# EAGLE design hello.ftdi.44.guillem (EAGLE 5.11)
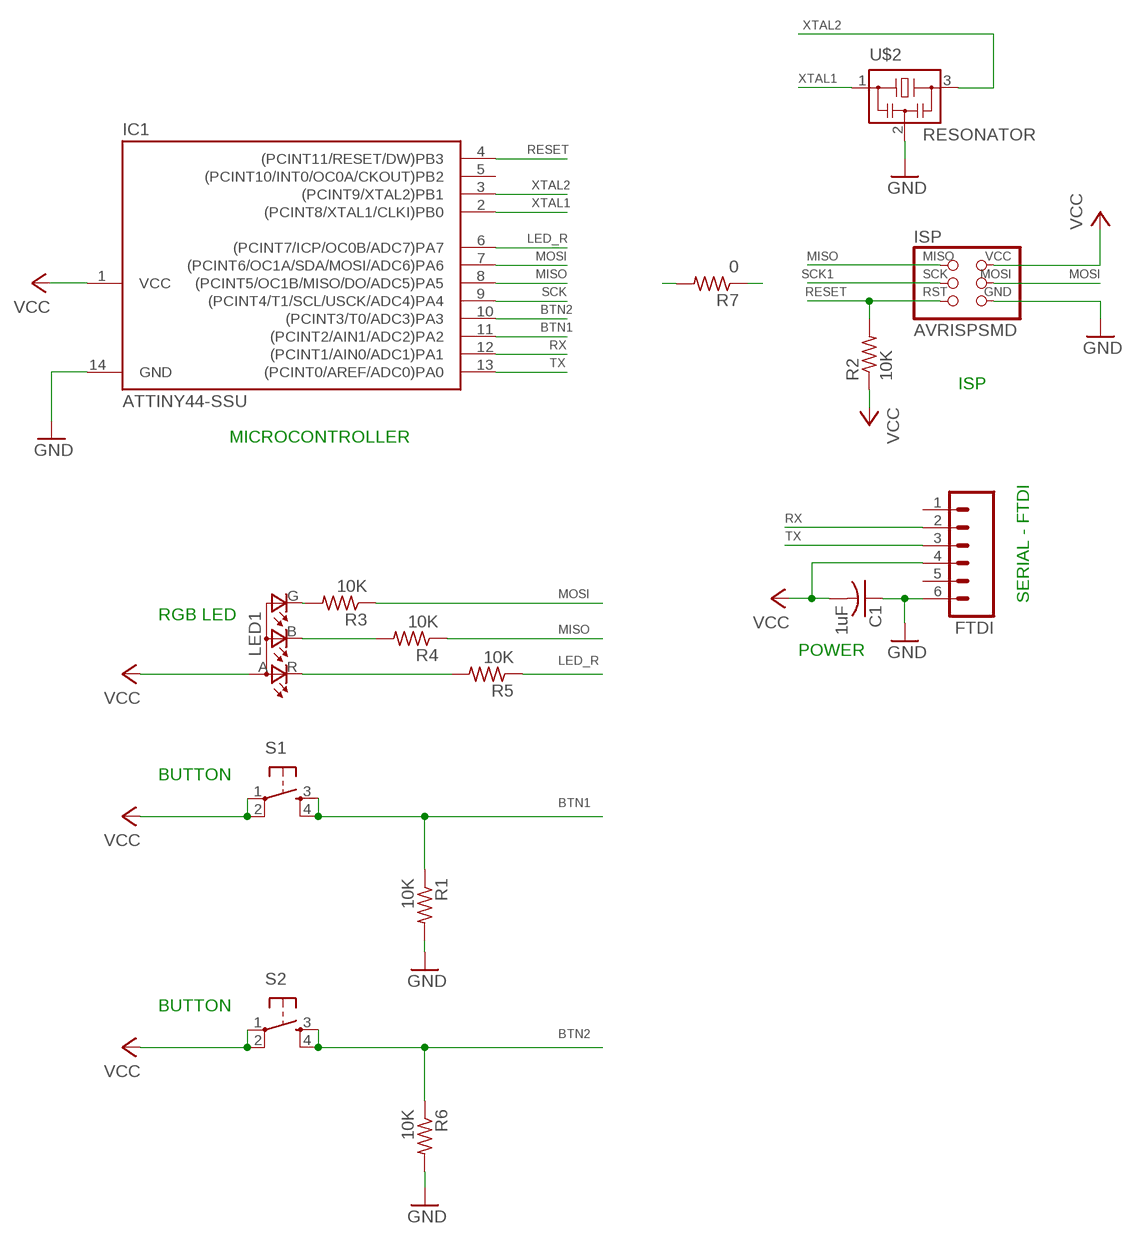
[diagram p0: schematic, sheet 1]

## Parts
C1  1uF  C-USC1206  [C1206]
FTDI  M06SMD  [1X06-SMD]
IC1  ATTINY44-SSU  [SOIC14]
ISP  AVRISPSMD  [2X03SMD]
LED1  LEDRGBOLD  [P-LCC-4-3]
R1  10K  R-US_R1206  [R1206]
R2  10K  R-US_R1206  [R1206]
R3  10K  R-US_R1206  [R1206]
R4  10K  R-US_R1206  [R1206]
R5  10K  R-US_R1206  [R1206]
R6  10K  R-US_R1206  [R1206]
R7  0  R-US_R1206  [R1206]
S1  6MM_SWITCH6MM_SWITCH  [6MM_SWITCH]
S2  6MM_SWITCH6MM_SWITCH  [6MM_SWITCH]
U$2  RESONATOR  [EFOBM]

## Nets
BTN1: IC1.11((PCINT2/AIN1/ADC2)PA2) R1.1 S1.3(S) S1.4(S1)
BTN2: IC1.10((PCINT3/T0/ADC3)PA3) R6.1 S2.3(S) S2.4(S1)
GND: C1.1 FTDI.6 IC1.14(GND) ISP.6(GND) R1.2 R6.2 U$2.2
LED_R: IC1.6((PCINT7/ICP/OC0B/ADC7)PA7) R5.1
MISO: IC1.8((PCINT5/OC1B/MISO/DO/ADC5)PA5) ISP.1(MISO) R4.1
MOSI: IC1.7((PCINT6/OC1A/SDA/MOSI/ADC6)PA6) ISP.4(MOSI) R3.1
N$5: LED1.G(CGREEN) R3.2
N$6: LED1.B(CBLUE) R4.2
N$7: LED1.R(CRED) R5.2
RESET: IC1.4((PCINT11/RESET/DW)PB3) ISP.5(RST) R2.2
RX: FTDI.2 IC1.12((PCINT1/AIN0/ADC1)PA1)
SCK: IC1.9((PCINT4/T1/SCL/USCK/ADC4)PA4) R7.2
SCK1: ISP.3(SCK) R7.1
TX: FTDI.3 IC1.13((PCINT0/AREF/ADC0)PA0)
VCC: C1.2 FTDI.4 IC1.1(VCC) ISP.2(VCC) LED1.A(A2) R2.1 S1.1(P) S1.2(P1) S2.1(P) S2.2(P1)
XTAL1: IC1.2((PCINT8/XTAL1/CLKI)PB0) U$2.1
XTAL2: IC1.3((PCINT9/XTAL2)PB1) U$2.3
Unconnected: FTDI.1 FTDI.5 IC1.5((PCINT10/INT0/OC0A/CKOUT)PB2)

## Notes on the sheet
- ISP
- MICROCONTROLLER
- SERIAL - FTDI
- RGB LED
- POWER
- BUTTON
- BUTTON

## Library data of the parts
C1 = resistor:C-US: CAPACITOR, American symbol
FTDI = SparkFun:M06: Header 6 Standard 6-pin 0.1" header. Use with straight break away headers (SKU : PRT-00116), right angle break away headers (PRT-00553), swiss pins (PRT-00743), machine pins (PRT-00117), and female headers (PRT-00115). Molex polarized connector foot print use with SKU : PRT-08094 with associated crimp pins and housings. NOTES ON THE VARIANTS LOCK and LOCK_LONGPADS... This footprint was designed to help hold the alignment of a through-hole component (i.e. 6-pin header) while soldering it into place. You may notice that each hole has been shifted either up or down by 0.005 of an inch from it's more standard position (which is a perfectly straight line). This slight alteration caused the pins (the squares in the middle) to touch the edges of the holes. Because they are alternating, it causes a "brace" to hold the component in place. 0.005 has proven to be the perfect amount of "off-center" position when using our standard breakaway headers. Although looks a little odd when you look at the bare footprint, once you have a header in there, the alteration is very hard to notice. Also, if you push a header all the way into place, it is covered up entirely on the bottom side. This idea of altering the position of holes to aid alignment will be further integrated into the Sparkfun Library for other footprints. It can help hold any component with 3 or more connection pins.
IC1 = fab:ATTINY44
ISP = fab:AVRISP
LED1 = fab:LEDRGBOLD: OSRAM Hyper Multi TOPLED® Hyper-Bright LED LATB T686 Source: http://www.osram.convergy.de/
R1-R7 = resistor:R-US_: RESISTOR, American symbol
S1 S2 = ng:6MM_SWITCH: OMRON SWITCH
U$2 = fab:RESONATOR

## Net classes
0 default: width 0.356 mm

## Board
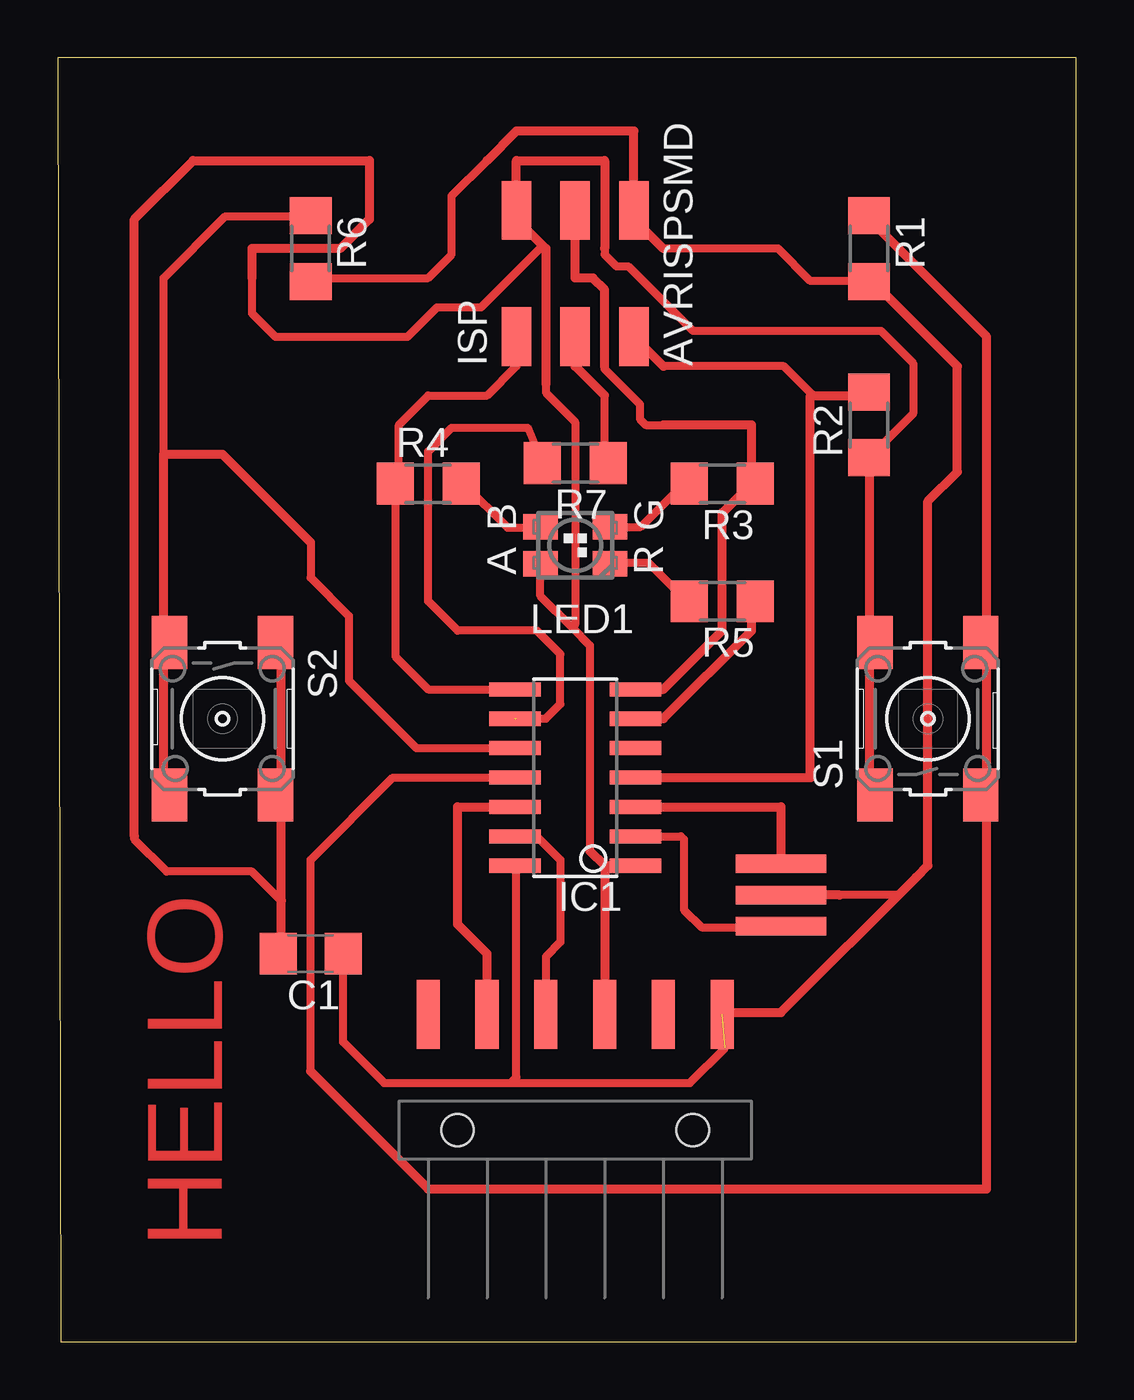
[diagram p1: board, top side]

Size 43.99 x 55.49 mm. Coordinates in mm from the lower left corner, seen from the top.
Outline: 0.13,0 43.99,0 43.99,55.49 0,55.49 0.13,0
Copper layers (1*16): Top 0.035mm / dielectric 1.5mm / Bottom 0.035mm
Design rules "default *": minimum track width 14mil, minimum drill 24mil, track to track 8mil, track to pad 8mil, pad to pad 8mil, via to via 8mil, smd to smd 8mil, copper to edge 40mil, drill to drill 8mil, minimum pad ring 10mil, minimum via ring 8mil, stop-mask expansion 4mil, vias tented up to drill 0mil, thermal gap 10mil

### Footprints (pad centres in the part's own frame; a part is rotated, then mirrored left to right if it is on the bottom)
C1206 = smd 1.6 x 1.8: 1 -1.4,0; 2 1.4,0
1X06-SMD = smd 1 x 3: 1 -6.35,5; 2 -3.81,5; 3 -1.27,5; 4 1.27,5; 5 3.81,5; 6 6.35,5 | hole 1.4: -5.08,0; 5.08,0
SOIC14 = smd 0.61 x 2.21: 1 -3.81,-2.603; 2 -2.54,-2.603; 3 -1.27,-2.603; 4 0,-2.603; 5 1.27,-2.603; 6 2.54,-2.603; 7 3.81,-2.603; 8 3.81,2.603; 9 2.54,2.603; 10 1.27,2.603; 11 0,2.603; 12 -1.27,2.603; 13 -2.54,2.603; 14 -3.81,2.603
2X03SMD = smd 2.54 x 1.27: 1 -2.54,2.54; 2 2.92,2.54; 3 -2.54,0; 4 2.92,0; 5 -2.54,-2.54; 6 2.92,-2.54
P-LCC-4-3 = smd 1.1 x 1.5: A -0.8,1.5; B 0.8,1.5; G 0.8,-1.5; R -0.8,-1.5
R1206 = smd 1.6 x 1.803: 1 -1.422,0; 2 1.422,0
6MM_SWITCH = smd 2.286 x 1.524: 1 -3.302,2.286; 2 3.302,2.286; 3 -3.302,-2.286; 4 3.302,-2.286
EFOBM = smd 0.8 x 3.9: 1 -1.35,0; 2 0,0; 3 1.35,0

### Placement (x,y rotation side)
C1  10.92,16.76 180 top
FTDI  22.35,9.14 0 top
IC1  22.35,24.38 90 top
ISP  22.35,45.97 90 top
LED1  22.35,34.42 90 top
R1  35.05,47.24 270 top
R2  35.05,39.62 90 top
R3  28.7,37.08 180 top
R4  16,37.08 0 top
R5  28.7,32 180 top
R6  10.92,47.24 270 top
R7  22.35,37.97 180 top
S1  37.59,26.92 90 top
S2  7.11,26.92 270 top
U$2  31.24,19.3 90 top

### Tracks (layer width: path | path; a pad name or v marks a point on that pad's centre or on a via)
BTN1
  Top 0.356: 10.92,11.68 10.92,20.83 14.48,24.38 IC1.11
  Top 0.381: R1.1 35.05,48.51 40.13,43.43 40.13,30.73 S1.4 40.13,29.46 40.13,24.38 S1.3 40.13,23.11 40.13,6.6 16,6.6 10.92,11.68 | IC1.11 19.81,24.38
BTN2
  Top 0.356: IC1.10 15.49,25.65 12.57,28.57 12.57,31.37 10.92,33.02 10.92,34.54 | 4.57,38.35 4.57,45.97 7.24,48.64 10.9,48.64 R6.1
  Top 0.381: R6.1 10.92,48.51 | 10.92,34.54 7.11,38.35 4.57,38.35 4.57,30.73 S2.3 4.57,29.46 4.57,24.38 S2.4 | IC1.10 19.81,25.65
GND  (1 unrouted)
  Top 0.356: 33.78,19.3 36.32,19.3 37.08,20.07 | 26.16,47.24 31.11,47.24 32.51,45.85 35.03,45.85 R1.2 | 19.56,11.18 27.3,11.18 28.83,12.7 | 19.81,20.57 19.81,11.43 19.56,11.18 | C1.1 12.32,12.95 14.1,11.18 19.56,11.18 | 10.92,45.97 16,45.97 17.02,46.99 17.02,49.53 18.54,51.05
  Top 0.381: C1.1 12.19,16.76 | 19.81,20.57 IC1.14 | 33.78,19.3 U$2.2 | FTDI.6 28.7,14.22 31.24,14.22 37.08,20.07 37.59,20.57 37.59,36.32 38.86,37.59 38.86,42.16 35.05,45.97 R1.2 | 18.54,51.05 19.81,52.32 24.89,52.32 ISP.6 24.89,48.51 26.16,47.24 | R6.2 10.92,45.97
LED_R
  Top 0.381: R5.1 29.97,32 29.97,30.73 26.16,26.92 IC1.6 24.89,26.92
MISO
  Top 0.356: ISP.1 19.81,42.16 18.54,40.89 16,40.89 14.73,39.62 14.73,37.24 R4.1 14.58,29.62 16,28.19 IC1.8
MOSI
  Top 0.356: 23.62,42.16 23.62,42.04 25.15,40.51 25.15,39.88 25.4,39.62 26.16,39.62
  Top 0.381: 29.97,37.08 28.7,35.81 28.7,30.73 26.16,28.19 IC1.7 24.89,28.19 | 23.62,42.16 23.62,45.47 23.11,45.97 22.35,45.97 ISP.4 | 26.16,39.62 29.97,39.62 29.97,37.08 | 29.97,37.08 R3.1
N$5
  Top 0.356: LED1.G 25.18,35.22 26.67,36.7 26.9,36.7 R3.2
N$6
  Top 0.356: R4.2 17.53,37.08 19.43,35.18 20.81,35.18 LED1.B
N$7
  Top 0.356: R5.2 27.18,32 25.53,33.66 23.89,33.66 LED1.R
  Top 0.381: R5.2 27.43,32
RESET
  Top 0.356: 26.16,42.16 31.37,42.16 32.64,40.89
  Top 0.381: 26.16,42.16 ISP.5 | R2.2 35.05,40.89 32.64,40.89 32.51,40.89 32.51,24.38 IC1.4 24.89,24.38
RX
  Top 0.381: 19.81,23.11 IC1.12 17.27,23.11 17.27,18.03 18.54,16.76 FTDI.2
SCK  (1 unrouted)
  Top 0.356: 19.81,26.92 21.08,26.92 21.72,27.56 21.72,29.72 20.7,30.73 17.27,30.73 16,32 16,38.48 17.02,39.5 20.29,39.5 R7.2
SCK1
  Top 0.356: 23.62,40.89 23.62,38.12 R7.1
  Top 0.381: 23.62,40.89 22.35,42.16 ISP.3
TX
  Top 0.356: IC1.13 20.7,21.84 21.72,20.83 21.72,17.27 21.08,16.64 FTDI.3
VCC
  Top 0.356: LED1.A 20.85,32.23 22.22,30.86 | 22.22,30.86 22.99,30.1 22.99,21.21 | 3.3,21.84 3.3,21.72 4.7,20.32 8.38,20.32 9.65,19.05 | R2.1 36.96,40.11 36.96,42.29 35.56,43.69 27.43,43.69 24.64,46.48 24.13,46.48 23.62,46.99 23.62,47.24 | 21.08,47.24 20.83,47.24 18.29,44.7 16.38,44.7 15.11,43.43 9.4,43.43 8.38,44.45 8.38,45.97 | 22.22,30.86 22.35,30.99 22.35,39.75 21.08,41.02 21.08,41.4
  Top 0.381: R2.1 35.05,30.73 S1.2 35.05,29.46 35.05,24.38 S1.1 | C1.2 9.65,16.76 9.65,19.05 9.65,23.11 S2.2 9.65,24.38 9.65,29.46 S2.1 | 22.99,21.21 23.62,20.57 | 23.62,20.57 FTDI.4 | 23.62,20.57 IC1.1 | 21.08,41.4 21.08,47.24 19.81,48.51 ISP.2 19.81,51.05 23.62,51.05 23.62,47.24 | 3.3,21.84 3.3,48.51 5.84,51.05 13.46,51.05 13.46,48.51 12.19,47.24 8.38,47.24 8.38,45.97
XTAL1
  Top 0.356: IC1.2 26.92,21.84 27.05,21.72 27.05,18.67 27.81,17.91 31.2,17.91 U$2.1
  Top 0.381: IC1.2 24.89,21.84
XTAL2
  Top 0.381: 24.89,23.11 IC1.3 31.24,23.11 U$2.3 31.24,20.57

### Text on the board
Top: HELLO